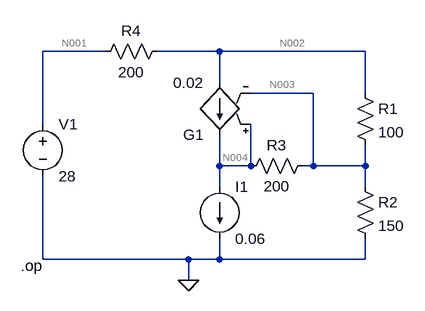
[diagram p0: schematic dependent_source_2.asc]
dependent_source_2.asc, the LTspice schematic file:
Version 4
SHEET 1 880 680
WIRE 32 -48 -64 -48
WIRE 208 -48 112 -48
WIRE 432 -48 208 -48
WIRE 208 0 208 -48
WIRE 352 16 256 16
WIRE 432 16 432 -48
WIRE -64 64 -64 -48
WIRE 208 128 208 80
WIRE 256 128 256 64
WIRE 256 128 208 128
WIRE 352 128 352 16
WIRE 352 128 336 128
WIRE 432 128 432 96
WIRE 432 128 352 128
WIRE 208 160 208 128
WIRE 432 160 432 128
WIRE -64 272 -64 144
WIRE 160 272 -64 272
WIRE 208 272 208 240
WIRE 208 272 160 272
WIRE 432 272 432 240
WIRE 432 272 208 272
WIRE 160 304 160 272
FLAG 160 304 0
SYMBOL voltage -64 48 R0
SYMATTR InstName V1
SYMATTR Value 28
SYMBOL res 416 0 R0
SYMATTR InstName R1
SYMATTR Value 100
SYMBOL res 416 144 R0
SYMATTR InstName R2
SYMATTR Value 150
SYMBOL res 240 144 R270
WINDOW 0 32 56 VTop 2
WINDOW 3 0 56 VBottom 2
SYMATTR InstName R3
SYMATTR Value 200
SYMBOL res 16 -32 R270
WINDOW 0 32 56 VTop 2
WINDOW 3 0 56 VBottom 2
SYMATTR InstName R4
SYMATTR Value 200
SYMBOL current 208 160 R0
SYMATTR InstName I1
SYMATTR Value 0.06
SYMBOL g 208 96 R180
SYMATTR InstName G1
SYMATTR Value 0.02
TEXT -98 282 Left 2 !.op

The netlist it stands for:
* dependent_source_2.asc
V1 N001 0 28
R1 N002 N003 100
R2 N003 0 150
R3 N004 N003 200
R4 N001 N002 200
I1 N004 0 0.06
G1 N002 N004 N004 N003 0.02
.op
.backanno
.end

* Results of the author's LTspice run, read from the files saved beside the schematic
* Operating Point:
*   V(n001) = 28 V
*   V(n002) = 8 V
*   V(n003) = 6 V
*   V(n004) = 10 V
*   I(I1) = 60 mA
*   I(R4) = 100 mA
*   I(R3) = 20 mA
*   I(R2) = 40 mA
*   I(R1) = 20 mA
*   I(G1) = 80 mA
*   I(V1) = -100 mA